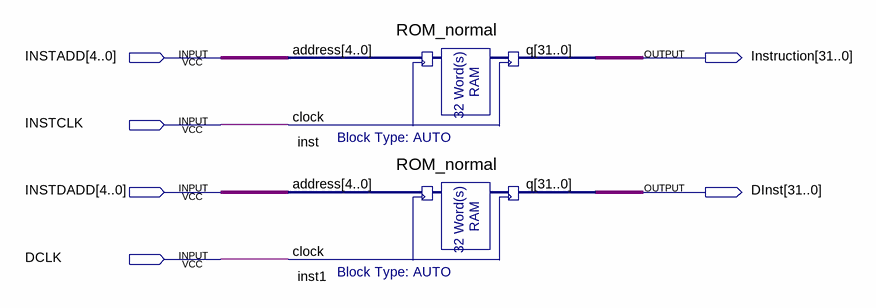
[diagram p0: schematic sheet]
// Quartus schematic ifetch.bdf as structural Verilog: 2 symbols, 6 pins
module ifetch (
  input  [4:0] INSTADD,
  input  INSTCLK,
  input  [4:0] INSTDADD,
  input  DCLK,
  output [31:0] Instruction,
  output [31:0] DInst
);

  ROM_normal inst (.address(INSTADD), .clock(INSTCLK), .q(Instruction));
  ROM_normal inst1 (.address(INSTDADD), .clock(DCLK), .q(DInst));
endmodule
